# EAGLE design buttons (EAGLE 7.3.0)
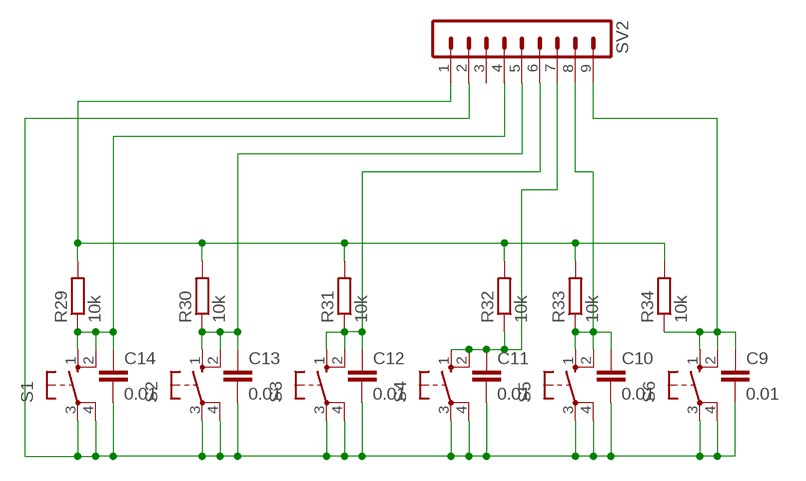
[diagram p0: schematic, sheet 1]

## Parts
C9  0.01  C-EUC0805  [C0805]
C10  0.01  C-EUC0805  [C0805]
C11  0.01  C-EUC0805  [C0805]
C12  0.01  C-EUC0805  [C0805]
C13  0.01  C-EUC0805  [C0805]
C14  0.01  C-EUC0805  [C0805]
R29  10k  R-EU_R0805  [R0805]
R30  10k  R-EU_R0805  [R0805]
R31  10k  R-EU_R0805  [R0805]
R32  10k  R-EU_R0805  [R0805]
R33  10k  R-EU_R0805  [R0805]
R34  10k  R-EU_R0805  [R0805]
S1  40-XX  [B3F-40XX]
S2  40-XX  [B3F-40XX]
S3  40-XX  [B3F-40XX]
S4  40-XX  [B3F-40XX]
S5  40-XX  [B3F-40XX]
S6  40-XX  [B3F-40XX]
SV2  MA09-1  [MA09-1]

## Nets
N$60: C13.1 R30.1 S2.1(S) S2.2(S1) SV2.5
N$77: C11.1 R32.1 S4.1(S) S4.2(S1) SV2.7
N$78: C10.1 R33.1 S5.1(S) S5.2(S1) SV2.8
N$79: C14.1 R29.1 S1.1(S) S1.2(S1) SV2.4
N$80: C9.1 R34.1 S6.1(S) S6.2(S1) SV2.9
N$81: R29.2 R30.2 R31.2 R32.2 R33.2 R34.2 SV2.1
N$82: C9.2 C10.2 C11.2 C12.2 C13.2 C14.2 S1.3(P) S1.4(P1) S2.3(P) S2.4(P1) S3.3(P) S3.4(P1) S4.3(P) S4.4(P1) S5.3(P) S5.4(P1) S6.3(P) S6.4(P1) SV2.2
N$83: C12.1 R31.1 S3.1(S) S3.2(S1) SV2.6
Unconnected: SV2.3

## Library data of the parts
C9-C14 = rcl:C-EU: CAPACITOR, European symbol
R29-R34 = rcl:R-EU_: RESISTOR, European symbol
S1-S6 = switch-omron:40-XX: OMRON SWITCH; MF: OMRON COMPONENTS USA; MPN: B3F-4000; OC_FARNELL: 176434; OC_NEWARK: 36K3105
SV2 = con-lstb:MA09-1: PIN HEADER; OC_FARNELL: unknown; OC_NEWARK: unknown

## Board
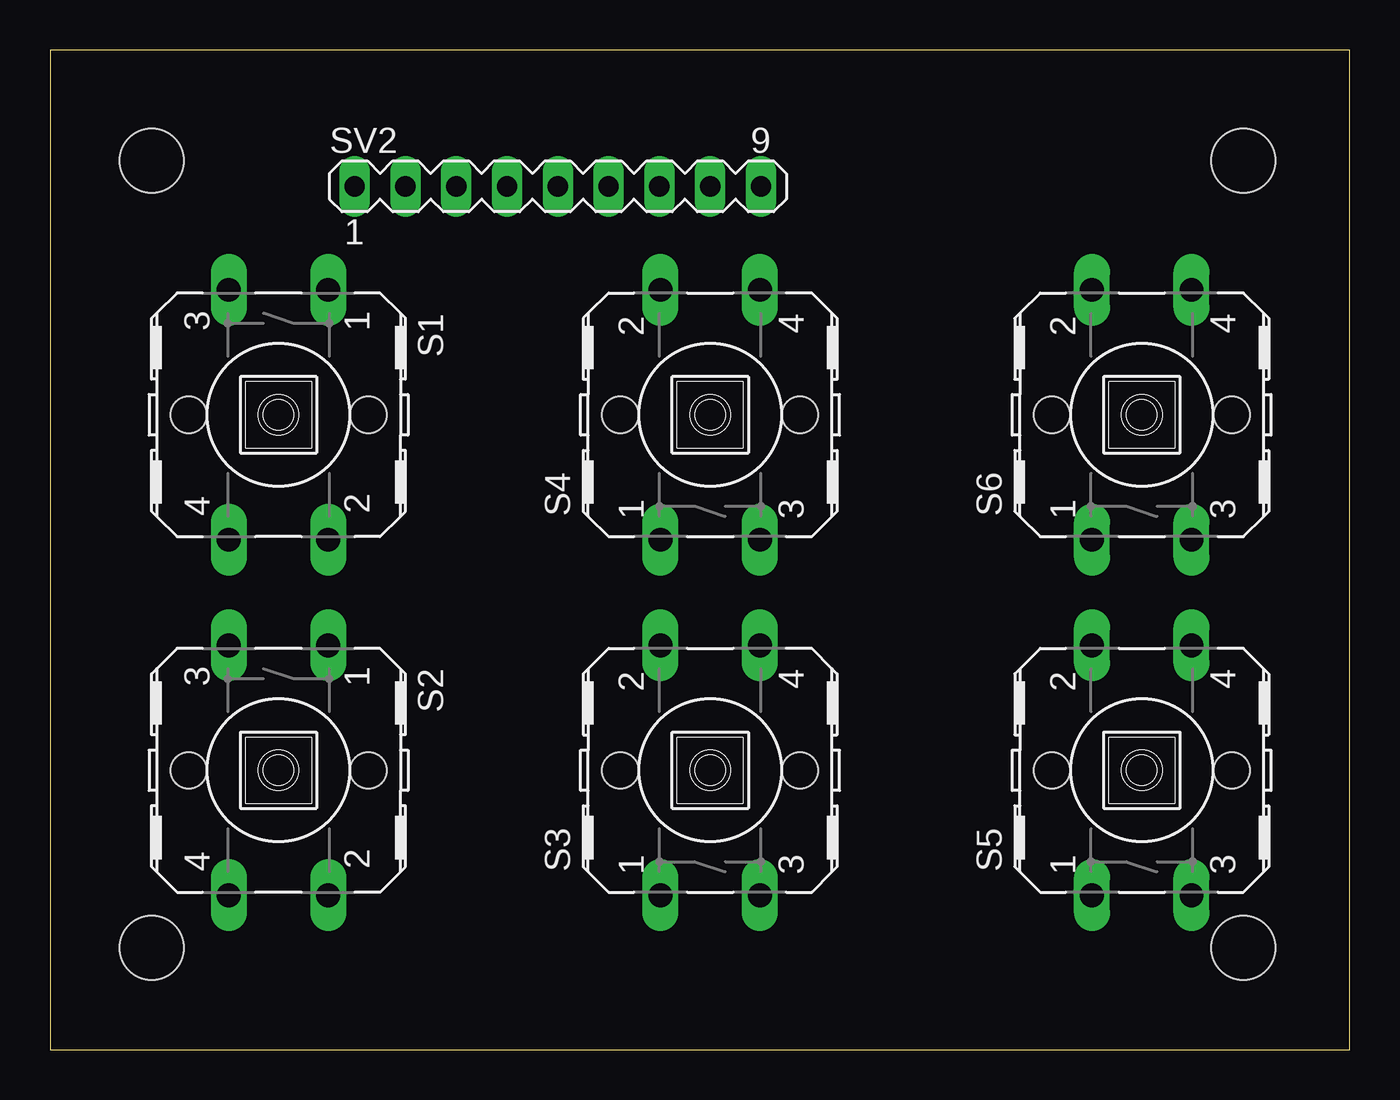
[diagram p1: board, top side]
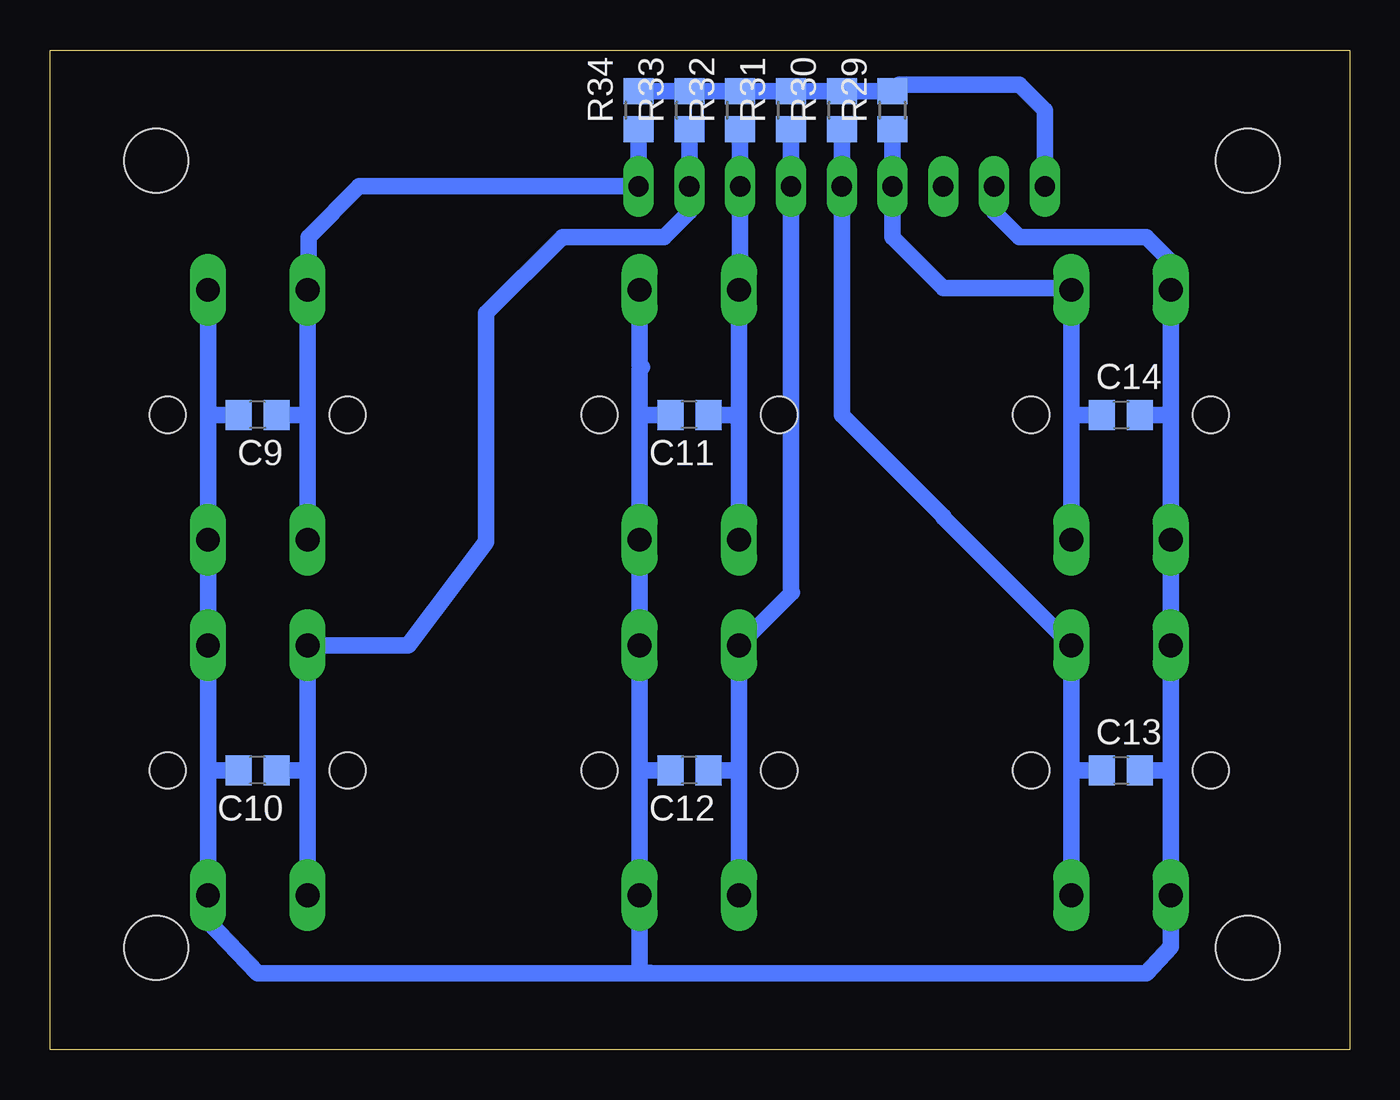
[diagram p2: board, bottom side, seen from below]

Size 65 x 50 mm. Coordinates in mm from the lower left corner, seen from the top.
Outline: 0,0 65,0 65,50 0,50 0,0
Copper layers (1*16): Top 0.035mm / dielectric 1.5mm / Bottom 0.035mm
Design rules "default": minimum track width 10mil, minimum drill 24mil, track to track 8mil, track to pad 8mil, pad to pad 8mil, via to via 8mil, smd to smd 8mil, copper to edge 40mil, drill to drill 8mil, minimum pad ring 10mil, minimum via ring 8mil, stop-mask expansion 4mil, vias tented up to drill 0mil, thermal gap 10mil
Holes 3.2 mm at 5.08,5.08 59.69,5.08 59.69,44.45 5.08,44.45

### Footprints (pad centres in the part's own frame; a part is rotated, then mirrored left to right if it is on the bottom)
C0805 = smd 1.3 x 1.5: 1 -0.95,0; 2 0.95,0
R0805 = smd 1.3 x 1.5: 1 -0.95,0; 2 0.95,0
B3F-40XX = drill 1.194 long: 1 -6.248,2.489; 2 6.248,2.489; 3 -6.248,-2.489; 4 6.248,-2.489 | hole 1.803: 0,-4.496; 0,4.496
MA09-1 = drill 1.016 long: 1 -10.16,0; 2 -7.62,0; 3 -5.08,0; 4 -2.54,0; 5 0,0; 6 2.54,0; 7 5.08,0; 8 7.62,0; 9 10.16,0

### Placement (x,y rotation side)
C9  54.61,31.75 180 bottom
C10  54.61,13.97 180 bottom
C11  33.02,31.75 180 bottom
C12  33.02,13.97 180 bottom
C13  11.43,13.97 0 bottom
C14  11.43,31.75 0 bottom
R29  22.86,46.99 90 bottom
R30  25.4,46.99 90 bottom
R31  27.94,46.99 90 bottom
R32  30.48,46.99 90 bottom
R33  33.02,46.99 90 bottom
R34  35.56,46.99 90 bottom
S1  11.43,31.75 270 top
S2  11.43,13.97 270 top
S3  33.02,13.97 90 top
S4  33.02,31.75 90 top
S5  54.61,13.97 90 top
S6  54.61,31.75 90 top
SV2  25.4,43.18 0 top

### Tracks (layer width: path | path; a pad name or v marks a point on that pad's centre or on a via)
N$60
  Bottom 0.813: R30.1 SV2.5 25.4,31.75 20.32,26.67 20.32,26.62 S2.1 13.92,13.97 | 13.92,13.97 S2.2 | C13.1 13.92,13.97
N$77
  Bottom 0.813: R32.1 SV2.7 30.48,38.05 S4.2 30.53,31.75 | 30.53,31.75 S4.1 | C11.1 30.53,31.75
N$78
  Bottom 0.813: R33.1 SV2.8 33.02,41.91 34.29,40.64 39.37,40.64 43.18,36.83 43.18,25.4 47.09,20.22 S5.2 52.12,13.97 | 52.12,13.97 S5.1 | C10.1 52.12,13.97
N$79
  Bottom 0.813: R29.1 SV2.4 22.86,40.64 20.32,38.1 14.02,38.1 S1.1 13.92,31.75 | 13.92,31.75 S1.2 | C14.1 13.92,31.75
N$80
  Bottom 0.813: R34.1 SV2.9 49.53,43.18 52.07,40.64 52.07,38.05 S6.2 52.12,31.75 | 52.12,31.75 S6.1 | C9.1 52.12,31.75
N$81
  Bottom 0.813: R34.2 R33.2 R32.2 R31.2 R30.2 R29.2 22.54,48.26 16.51,48.26 15.24,46.99 SV2.1
N$82
  Bottom 0.813: 34.29,3.81 10.16,3.81 8.94,5.13 S2.4 8.94,13.97 | 34.29,3.81 54.61,3.81 57.1,6.4 S5.3 57.1,13.97 | 34.29,3.81 35.51,3.86 S3.3 35.51,13.97 | 35.51,13.97 S3.4 35.51,21.79 35.56,21.79 35.56,20.32 35.51,20.32 S4.3 35.51,31.75 | S5.4 S6.3 57.1,31.75 | S5.4 57.1,19.1 57.15,19.05 57.15,20.17 S5.4 | 57.1,13.97 S5.4 | 8.94,31.75 S1.3 8.89,38.05 8.89,39.37 10.16,40.64 16.51,40.64 17.78,41.91 SV2.2 | 8.94,31.75 S1.4 S2.3 8.94,13.97 | 35.51,31.75 35.51,34.02 35.4,34.13 35.51,34.24 S4.4 | C14.2 8.94,31.75 | C13.2 8.94,13.97 | C12.2 35.51,13.97 | C10.2 57.1,13.97 | 57.1,31.75 S6.4 | C9.2 57.1,31.75 | C11.2 35.51,31.75
N$83
  Bottom 0.813: R31.1 SV2.6 27.94,22.91 27.89,22.86 S3.2 30.53,13.97 | 30.53,13.97 S3.1 | C12.1 30.53,13.97